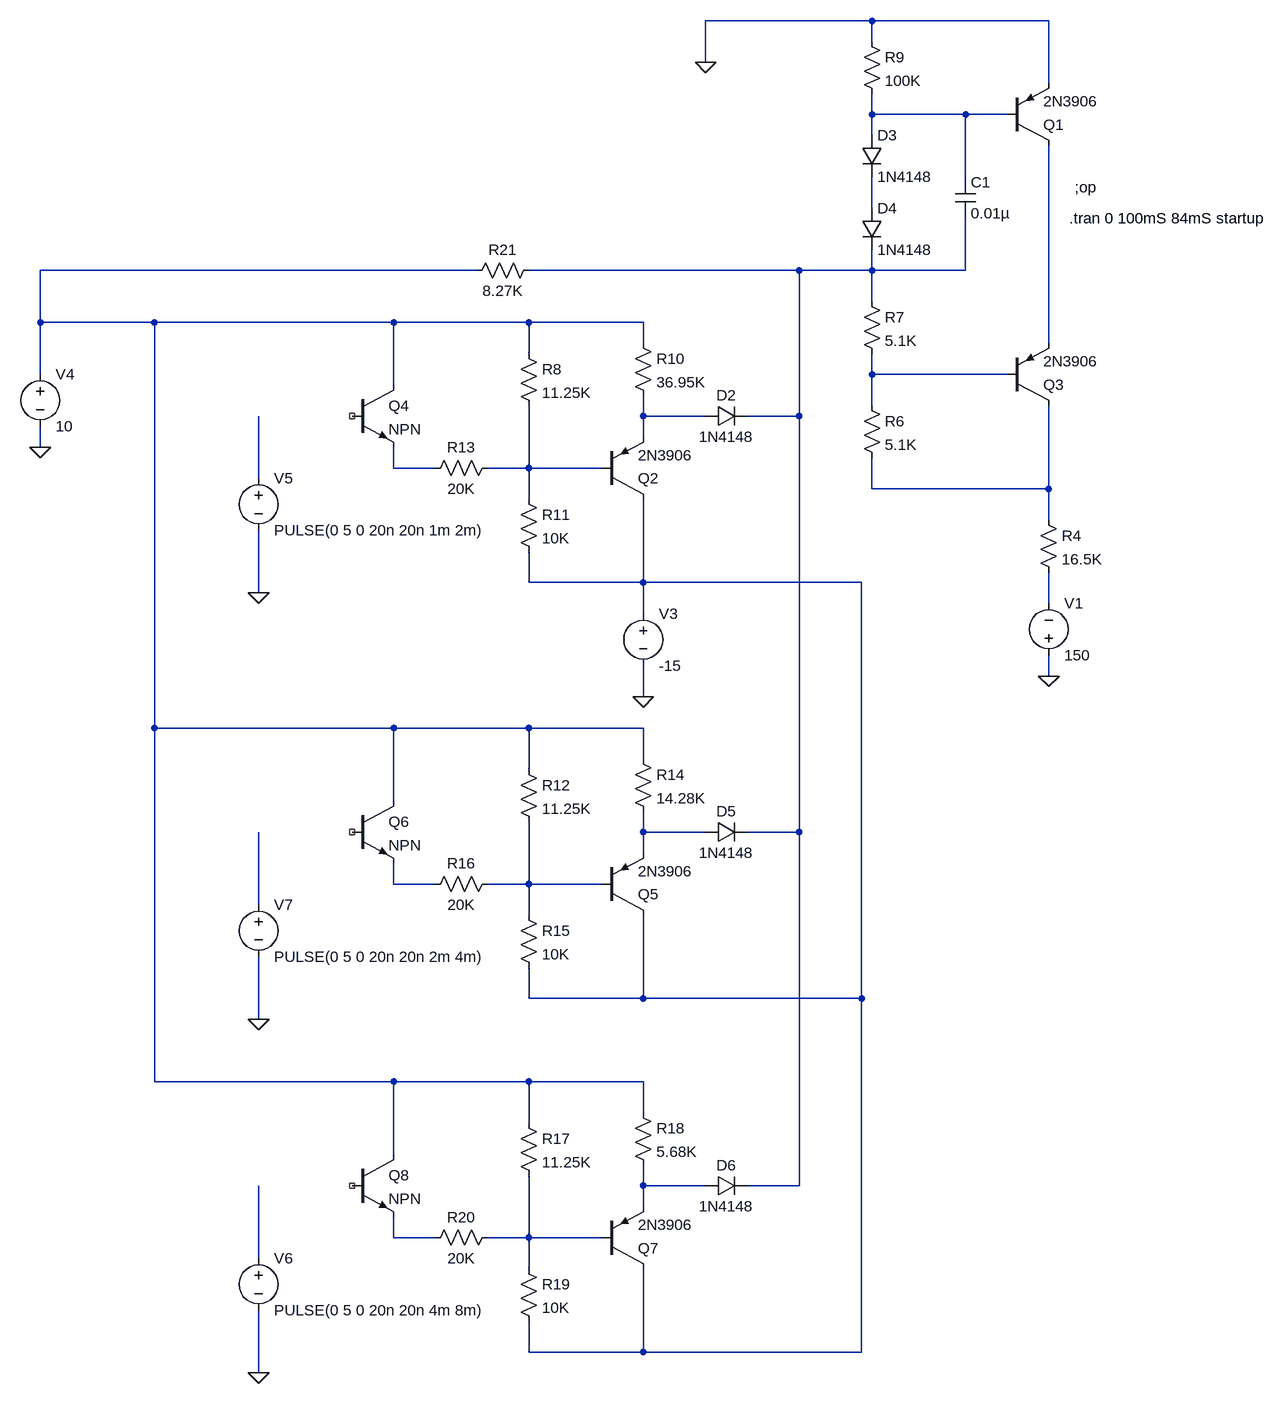
[diagram p0: schematic intensifier5.asc]
intensifier5.asc, the LTspice schematic file:
Version 4
SHEET 1 1476 1652
WIRE 640 -496 384 -496
WIRE 912 -496 640 -496
WIRE 640 -464 640 -496
WIRE 384 -432 384 -496
WIRE 912 -400 912 -496
WIRE 640 -352 640 -384
WIRE 784 -352 640 -352
WIRE 848 -352 784 -352
WIRE 640 -320 640 -352
WIRE 784 -256 784 -352
WIRE 640 -208 640 -256
WIRE 32 -112 -640 -112
WIRE 528 -112 112 -112
WIRE 640 -112 640 -144
WIRE 640 -112 528 -112
WIRE 784 -112 784 -192
WIRE 784 -112 640 -112
WIRE 640 -64 640 -112
WIRE -640 -32 -640 -112
WIRE -464 -32 -640 -32
WIRE -96 -32 -464 -32
WIRE 112 -32 -96 -32
WIRE 288 -32 112 -32
WIRE 288 0 288 -32
WIRE 912 0 912 -304
WIRE 112 16 112 -32
WIRE -640 48 -640 -32
WIRE 640 48 640 16
WIRE 848 48 640 48
WIRE -96 64 -96 -32
WIRE 640 96 640 48
WIRE 288 112 288 80
WIRE 384 112 288 112
WIRE 528 112 528 -112
WIRE 528 112 448 112
WIRE 288 144 288 112
WIRE -640 160 -640 128
WIRE -96 192 -96 160
WIRE -32 192 -96 192
WIRE 112 192 112 96
WIRE 112 192 48 192
WIRE 224 192 112 192
WIRE -304 208 -304 112
WIRE 640 224 640 176
WIRE 912 224 912 96
WIRE 912 224 640 224
WIRE 112 240 112 192
WIRE 912 272 912 224
WIRE 112 368 112 320
WIRE 288 368 288 240
WIRE 288 368 112 368
WIRE 624 368 288 368
WIRE -304 384 -304 288
WIRE 912 400 912 352
WIRE 288 416 288 368
WIRE 912 512 912 480
WIRE 288 544 288 496
WIRE -464 592 -464 -32
WIRE -96 592 -464 592
WIRE 112 592 -96 592
WIRE 288 592 112 592
WIRE 288 640 288 592
WIRE 112 656 112 592
WIRE -96 704 -96 592
WIRE 288 752 288 720
WIRE 384 752 288 752
WIRE 528 752 528 112
WIRE 528 752 448 752
WIRE 288 784 288 752
WIRE -96 832 -96 800
WIRE -32 832 -96 832
WIRE 112 832 112 736
WIRE 112 832 48 832
WIRE 224 832 112 832
WIRE -304 864 -304 752
WIRE 112 880 112 832
WIRE 112 1008 112 960
WIRE 288 1008 288 880
WIRE 288 1008 112 1008
WIRE 624 1008 624 368
WIRE 624 1008 288 1008
WIRE -304 1040 -304 944
WIRE -464 1136 -464 592
WIRE -96 1136 -464 1136
WIRE 112 1136 -96 1136
WIRE 288 1136 112 1136
WIRE 288 1184 288 1136
WIRE 112 1200 112 1136
WIRE -96 1248 -96 1136
WIRE 288 1296 288 1264
WIRE 384 1296 288 1296
WIRE 528 1296 528 752
WIRE 528 1296 448 1296
WIRE 288 1328 288 1296
WIRE -96 1376 -96 1344
WIRE -32 1376 -96 1376
WIRE 112 1376 112 1280
WIRE 112 1376 48 1376
WIRE 224 1376 112 1376
WIRE -304 1408 -304 1296
WIRE 112 1424 112 1376
WIRE 112 1552 112 1504
WIRE 288 1552 288 1424
WIRE 288 1552 112 1552
WIRE 624 1552 624 1008
WIRE 624 1552 288 1552
WIRE -304 1584 -304 1488
FLAG 912 512 0
FLAG 384 -432 0
FLAG 288 544 0
FLAG -640 160 0
FLAG -304 384 0
FLAG -304 1040 0
FLAG -304 1584 0
SYMBOL pnp 848 -304 M180
SYMATTR InstName Q1
SYMATTR Value 2N3906
SYMBOL pnp 848 96 M180
SYMATTR InstName Q3
SYMATTR Value 2N3906
SYMBOL res 896 256 R0
SYMATTR InstName R4
SYMATTR Value 16.5K
SYMBOL res 624 80 R0
SYMATTR InstName R6
SYMATTR Value 5.1K
SYMBOL res 624 -80 R0
SYMATTR InstName R7
SYMATTR Value 5.1K
SYMBOL diode 624 -320 R0
SYMATTR InstName D3
SYMATTR Value 1N4148
SYMBOL diode 624 -208 R0
SYMATTR InstName D4
SYMATTR Value 1N4148
SYMBOL res 624 -480 R0
SYMATTR InstName R9
SYMATTR Value 100K
SYMBOL voltage 912 496 M180
WINDOW 0 24 96 Left 2
WINDOW 3 24 16 Left 2
WINDOW 123 0 0 Left 0
WINDOW 39 0 0 Left 0
SYMATTR InstName V1
SYMATTR Value 150
SYMBOL pnp 224 240 M180
SYMATTR InstName Q2
SYMATTR Value 2N3906
SYMBOL res 96 0 R0
SYMATTR InstName R8
SYMATTR Value 11.25K
SYMBOL res 272 -16 R0
SYMATTR InstName R10
SYMATTR Value 36.95K
SYMATTR SpiceLine tol=1
SYMBOL diode 384 96 M90
WINDOW 0 0 32 VBottom 2
WINDOW 3 32 32 VTop 2
SYMATTR InstName D2
SYMATTR Value 1N4148
SYMBOL voltage 288 400 R0
WINDOW 123 0 0 Left 0
WINDOW 39 0 0 Left 0
SYMATTR InstName V3
SYMATTR Value -15
SYMBOL voltage -640 32 R0
WINDOW 123 0 0 Left 0
WINDOW 39 0 0 Left 0
SYMATTR InstName V4
SYMATTR Value 10
SYMBOL res 96 224 R0
SYMATTR InstName R11
SYMATTR Value 10K
SYMBOL npn -160 64 R0
SYMATTR InstName Q4
SYMBOL voltage -304 192 R0
WINDOW 123 0 0 Left 0
WINDOW 39 0 0 Left 0
SYMATTR InstName V5
SYMATTR Value PULSE(0 5 0 20n 20n 1m 2m)
SYMBOL res 64 176 R90
WINDOW 0 0 56 VBottom 2
WINDOW 3 32 56 VTop 2
SYMATTR InstName R13
SYMATTR Value 20K
SYMBOL cap 768 -256 R0
SYMATTR InstName C1
SYMATTR Value 0.01µ
SYMATTR SpiceLine V=16 Irms=647m Rser=0.0322889 Lser=0 mfg="KEMET" pn="C0201C103K4PAC" type="X5R"
SYMBOL pnp 224 880 M180
SYMATTR InstName Q5
SYMATTR Value 2N3906
SYMBOL res 96 640 R0
SYMATTR InstName R12
SYMATTR Value 11.25K
SYMBOL res 272 624 R0
SYMATTR InstName R14
SYMATTR Value 14.28K
SYMATTR SpiceLine tol=1
SYMBOL diode 384 736 M90
WINDOW 0 0 32 VBottom 2
WINDOW 3 32 32 VTop 2
SYMATTR InstName D5
SYMATTR Value 1N4148
SYMBOL res 96 864 R0
SYMATTR InstName R15
SYMATTR Value 10K
SYMBOL npn -160 704 R0
SYMATTR InstName Q6
SYMBOL voltage -304 848 R0
WINDOW 123 0 0 Left 0
WINDOW 39 0 0 Left 0
SYMATTR InstName V7
SYMATTR Value PULSE(0 5 0 20n 20n 2m 4m)
SYMBOL res 64 816 R90
WINDOW 0 0 56 VBottom 2
WINDOW 3 32 56 VTop 2
SYMATTR InstName R16
SYMATTR Value 20K
SYMBOL pnp 224 1424 M180
SYMATTR InstName Q7
SYMATTR Value 2N3906
SYMBOL res 96 1184 R0
SYMATTR InstName R17
SYMATTR Value 11.25K
SYMBOL res 272 1168 R0
SYMATTR InstName R18
SYMATTR Value 5.68K
SYMATTR SpiceLine tol=1
SYMBOL diode 384 1280 M90
WINDOW 0 0 32 VBottom 2
WINDOW 3 32 32 VTop 2
SYMATTR InstName D6
SYMATTR Value 1N4148
SYMBOL res 96 1408 R0
SYMATTR InstName R19
SYMATTR Value 10K
SYMBOL npn -160 1248 R0
SYMATTR InstName Q8
SYMBOL voltage -304 1392 R0
WINDOW 123 0 0 Left 0
WINDOW 39 0 0 Left 0
SYMATTR InstName V6
SYMATTR Value PULSE(0 5 0 20n 20n 4m 8m)
SYMBOL res 64 1360 R90
WINDOW 0 0 56 VBottom 2
WINDOW 3 32 56 VTop 2
SYMATTR InstName R20
SYMATTR Value 20K
SYMBOL res 128 -128 R90
WINDOW 0 0 56 VBottom 2
WINDOW 3 32 56 VTop 2
SYMATTR InstName R21
SYMATTR Value 8.27K
TEXT 952 -240 Left 2 !;op
TEXT 944 -192 Left 2 !.tran 0 100mS 84mS startup

The netlist it stands for:
* intensifier5.asc
Q1 N005 N001 0 0 2N3906
Q3 N011 N006 N005 0 2N3906
R4 N011 N013 16.5K
R6 N006 N011 5.1K
R7 N004 N006 5.1K
D3 N001 N002 1N4148
D4 N002 N004 1N4148
R9 0 N001 100K
V1 0 N013 150
Q2 N012 N009 N007 0 2N3906
R8 N003 N009 11.25K
R10 N003 N007 36.95K tol=1
D2 N007 N004 1N4148
V3 N012 0 -15
V4 N003 0 10
R11 N009 N012 10K
Q4 N003 NC_01 N008 0 NPN
V5 N010 0 PULSE(0 5 0 20n 20n 1m 2m)
R13 N009 N008 20K
C1 N001 N004 0.01µ V=16 Irms=647m Rser=0.0322889 Lser=0 mfg="KEMET" pn="C0201C103K4PAC" type="X5R"
Q5 N012 N016 N014 0 2N3906
R12 N003 N016 11.25K
R14 N003 N014 14.28K tol=1
D5 N014 N004 1N4148
R15 N016 N012 10K
Q6 N003 NC_02 N015 0 NPN
V7 N017 0 PULSE(0 5 0 20n 20n 2m 4m)
R16 N016 N015 20K
Q7 N012 N020 N018 0 2N3906
R17 N003 N020 11.25K
R18 N003 N018 5.68K tol=1
D6 N018 N004 1N4148
R19 N020 N012 10K
Q8 N003 NC_03 N019 0 NPN
V6 N021 0 PULSE(0 5 0 20n 20n 4m 8m)
R20 N020 N019 20K
R21 N004 N003 8.27K
.model D D
.lib standard.dio
.model NPN NPN
.model PNP PNP
.lib standard.bjt
;op
.tran 0 100mS 84mS startup
.backanno
.end